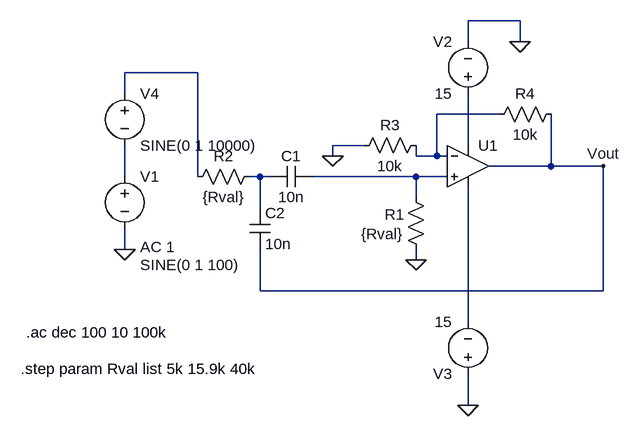
[diagram p0: schematic NotchFilter.asc]
NotchFilter.asc, the LTspice schematic file:
Version 4.1
SHEET 1 880 680
WIRE 112 -80 32 -80
WIRE 32 -48 32 -80
WIRE 112 -48 112 -80
WIRE -384 0 -496 0
WIRE -496 32 -496 0
WIRE 80 64 -16 64
WIRE -128 112 -176 112
WIRE 32 112 32 32
WIRE -176 128 -176 112
WIRE -48 128 -48 112
WIRE -16 128 -16 64
WIRE -16 128 -48 128
WIRE 0 128 -16 128
WIRE 160 144 160 64
WIRE 160 144 64 144
WIRE 240 144 160 144
WIRE -496 160 -496 112
WIRE -384 160 -384 0
WIRE -288 160 -304 160
WIRE -272 160 -288 160
WIRE -48 160 -208 160
WIRE 0 160 -48 160
WIRE -48 192 -48 160
WIRE -288 208 -288 160
WIRE -496 272 -496 240
WIRE -48 288 -48 272
WIRE -288 336 -288 272
WIRE 240 336 240 144
WIRE 240 336 -288 336
WIRE 32 384 32 176
WIRE 32 512 32 464
FLAG -496 272 0
FLAG -48 288 0
FLAG 112 -48 0
FLAG 32 512 0
FLAG 240 144 Vout
FLAG -176 128 0
SYMBOL OpAmps\\UniversalOpAmp2 32 144 R0
SYMATTR InstName U1
SYMBOL res -32 288 R180
WINDOW 0 33 70 Left 2
WINDOW 3 36 40 Left 2
SYMATTR InstName R1
SYMATTR Value {Rval}
SYMBOL res -400 176 R270
WINDOW 0 32 56 VTop 2
WINDOW 3 0 56 VBottom 2
SYMATTR InstName R2
SYMATTR Value {Rval}
SYMBOL cap -272 176 R270
WINDOW 0 32 32 VTop 2
WINDOW 3 0 32 VBottom 2
SYMATTR InstName C1
SYMATTR Value 10n
SYMBOL cap -304 208 R0
SYMATTR InstName C2
SYMATTR Value 10n
SYMBOL voltage -496 144 R0
WINDOW 3 24 152 Left 2
WINDOW 123 24 124 Left 2
WINDOW 39 0 0 Left 0
SYMATTR Value SINE(0 1 100)
SYMATTR Value2 AC 1
SYMATTR InstName V1
SYMBOL voltage 32 48 R180
WINDOW 0 24 96 Left 2
WINDOW 3 24 16 Left 2
WINDOW 123 0 0 Left 0
WINDOW 39 0 0 Left 0
SYMATTR InstName V2
SYMATTR Value 15
SYMBOL voltage 32 480 R180
WINDOW 123 0 0 Left 0
WINDOW 39 0 0 Left 0
SYMATTR InstName V3
SYMATTR Value 15
SYMBOL voltage -496 16 R0
WINDOW 123 0 0 Left 0
WINDOW 39 0 0 Left 0
SYMATTR InstName V4
SYMATTR Value SINE(0 1 10000)
SYMBOL res -32 96 R90
WINDOW 0 0 56 VBottom 2
WINDOW 3 32 56 VTop 2
SYMATTR InstName R3
SYMATTR Value 10k
SYMBOL res 176 48 R90
WINDOW 0 0 56 VBottom 2
WINDOW 3 32 56 VTop 2
SYMATTR InstName R4
SYMATTR Value 10k
TEXT -648 400 Left 2 !.ac dec 100 10 100k
TEXT -656 456 Left 2 !.step param Rval list 5k 15.9k 40k

The netlist it stands for:
* NotchFilter.asc
X§U1 N006 N002 N003 N007 Vout level2 Avol=1Meg GBW=10Meg Slew=10Meg Ilimit=25m Rail=0 Vos=0 En=0 Enk=0 In=0 Ink=0 Rin=500Meg  ; pins In+ In- V+ V- OUT
R1 0 N006 {Rval}
R2 N001 N005 {Rval}
C1 N005 N006 10n
C2 N005 Vout 10n
V1 N004 0 SINE(0 1 100) AC 1
V2 N003 0 15
V3 0 N007 15
V4 N001 N004 SINE(0 1 10000)
R3 N002 0 10k
R4 Vout N002 10k
.ac dec 100 10 100k
.step param Rval list 5k 15.9k 40k
.lib UniversalOpAmp2.lib
.backanno
.end